# Altium schematic sheet Sheet1.SchDoc
size A3; SheetNumber: 1; SheetTotal: 1
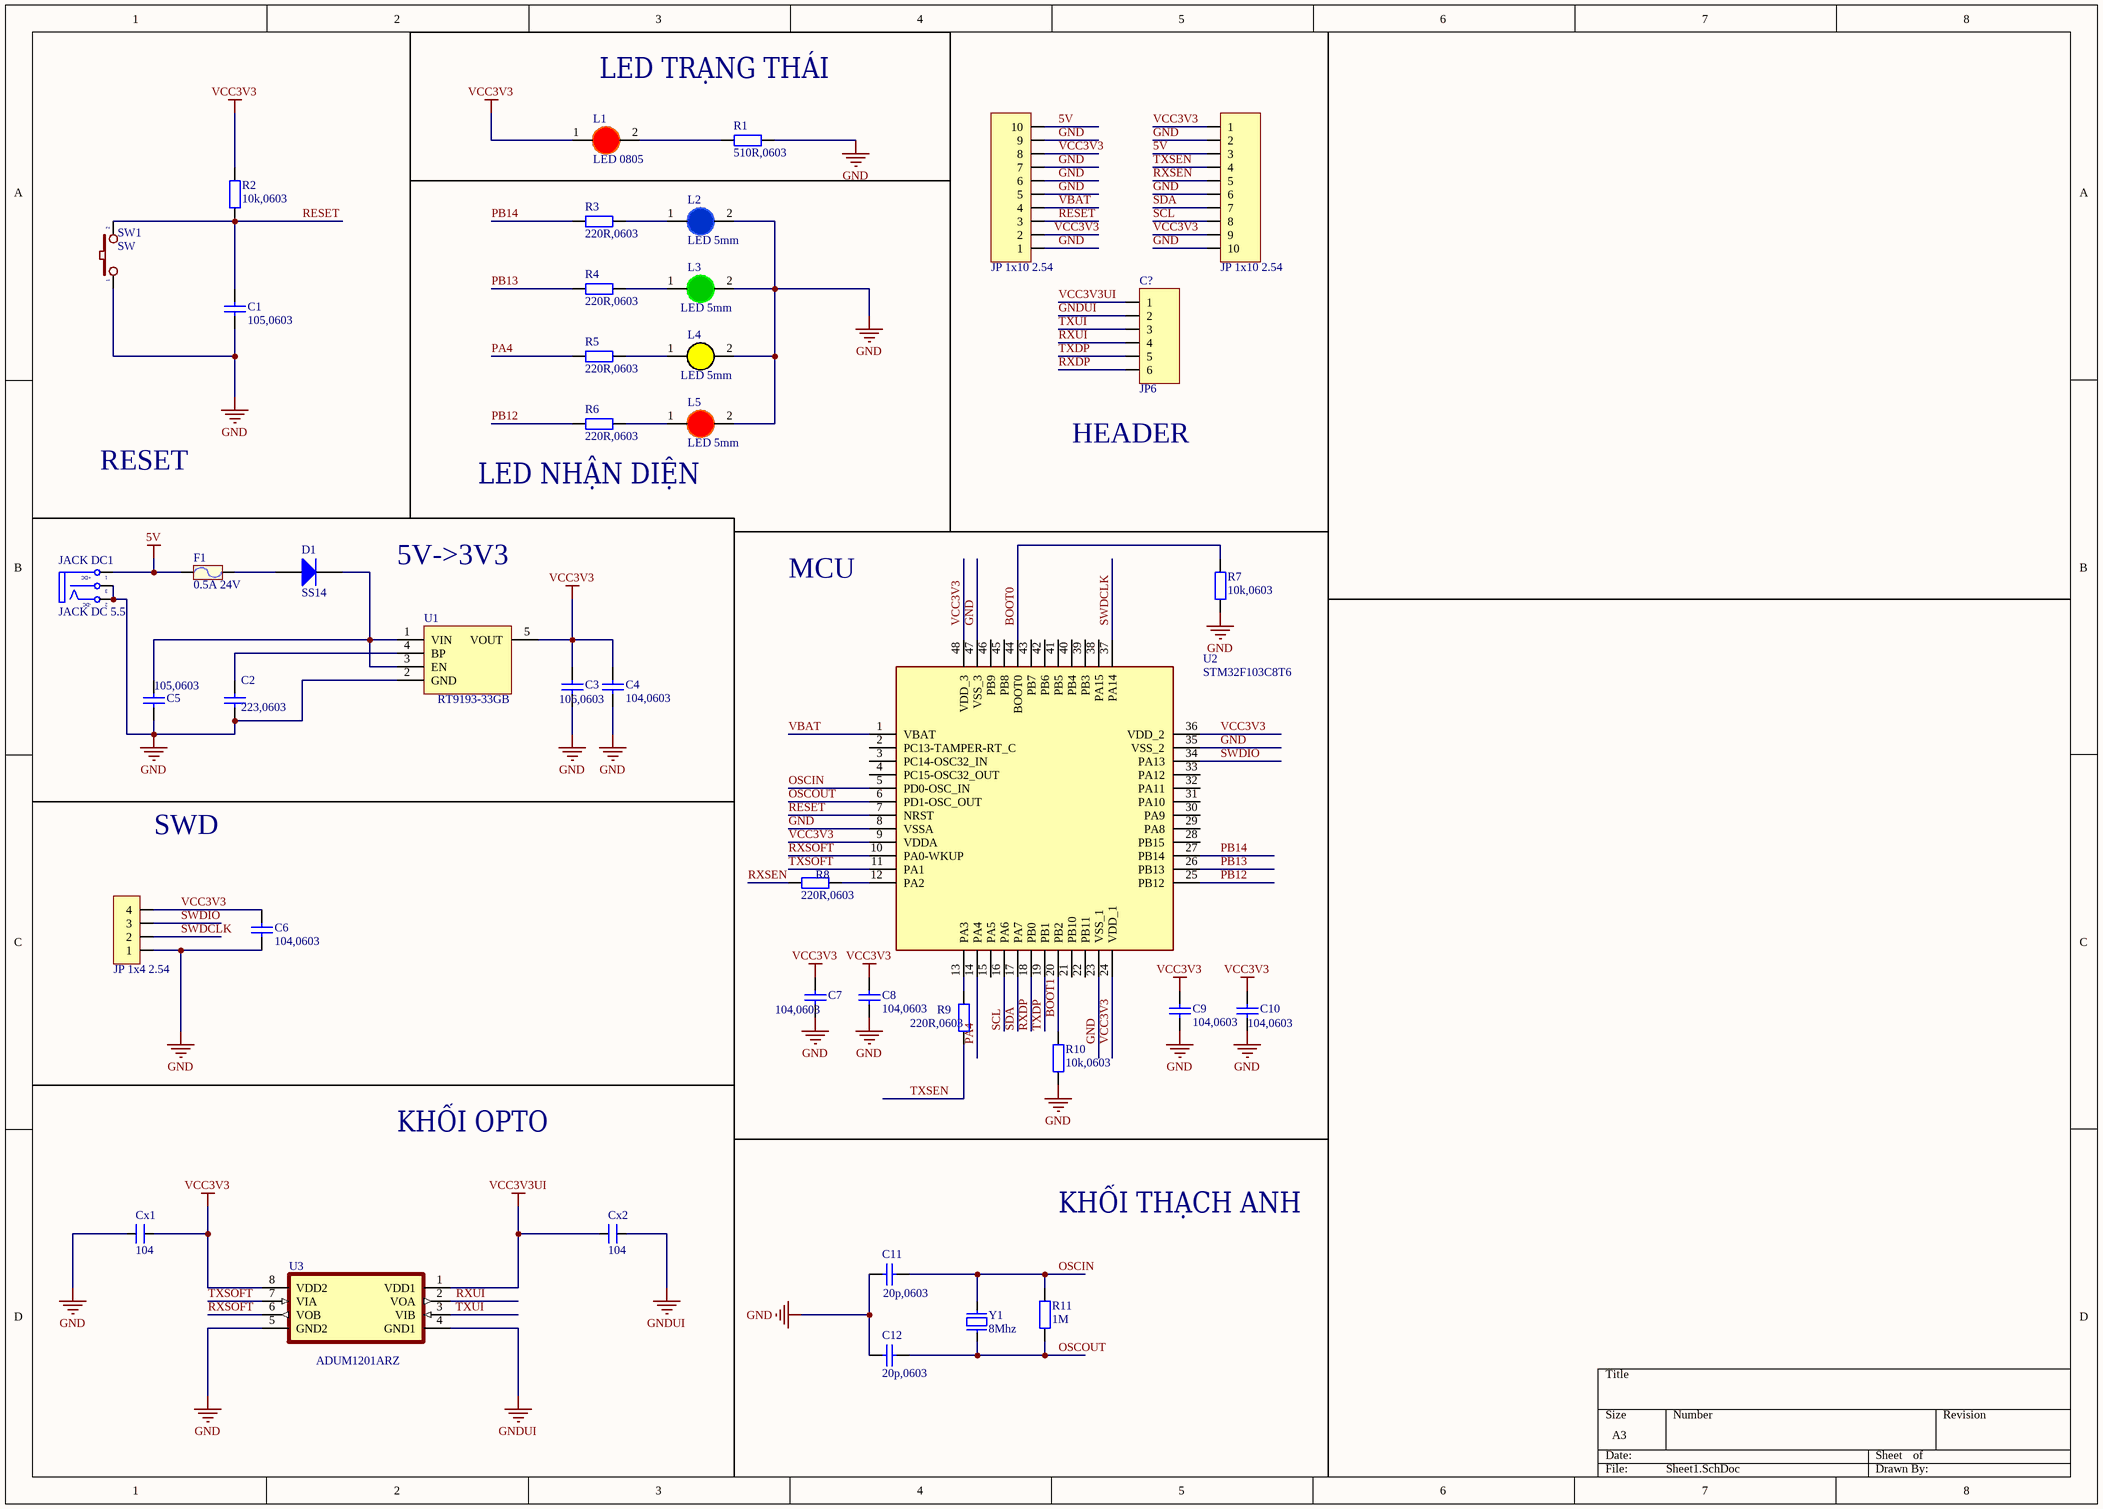
[diagram p0: Sheet1.SchDoc]

## Parts
C1  105,0603  [tu 0603]
C2  223,0603  [tu 0603]
C3  106,0603  [tu 0603]
C4  104,0603  [tu 0603]
C5  105,0603  [tu 0603]
C6  104,0603  [tu 0603]
C7  104,0603  [tu 0603]
C8  104,0603  [tu 0603]
C9  104,0603  [tu 0603]
C10  104,0603  [tu 0603]
C11  20p,0603  [tu 0603]
C12  20p,0603  [tu 0603]
C?  JP6  [JP6-D1C]
Cx1  104  [CN-SMD-0603]
Cx2  104  [CN-SMD-0603]
D1  SS14  [DIODE SMA]
F1  0.5A 24V  [Cau chi tu phuc hoi 2A 24V SMD1812]
JACK_DC1  JACK DC 5.5  [JACK DC 5.5]
JP1  JP 1x10 2.54  [JP 1x10 DT]
JP2  JP 1x10 2.54  [JP 1x10 DT]
JP4  JP 1x4 2.54  [JP 1x4 DC]
L1  LED 0805  [LED-0805-Red]
L2  LED 5mm  [LED-5MM-BLUE]
L3  LED 5mm  [LED-5MM-Green]
L4  LED 5mm  [LED-5MM-Yellow]
L5  LED 5mm  [LED-5MM-RED]
R1  510R,0603  [tro smd 0603]
R2  10k,0603  [tro smd 0603]
R3  220R,0603  [tro smd 0603]
R4  220R,0603  [tro smd 0603]
R5  220R,0603  [tro smd 0603]
R6  220R,0603  [tro smd 0603]
R7  10k,0603  [tro smd 0603]
R8  220R,0603  [tro smd 0603]
R9  220R,0603  [tro smd 0603]
R10  10k,0603  [tro smd 0603]
R11  1M  [tro smd 0603]
SW1  SW  [SW1-SMD]
U1  RT9193-33GB  [SOT23-5]
U2  STM32F103C8T6  [LQFP-48_19.6_393_58X11_SMD]
U3  ADUM1201ARZ  [SOIC127P600X175-8N]
Y1  8Mhz  [Thach Anh 2 chan cam]

## Nets
5V: F1.1 JACK_DC1.1(T) JP1.10 JP2.3
GND: C1.1 C2.1 C3.1 C4.1 C5.1 C6.1 C7.1 C8.1 C9.1 C10.1 C11.2 C12.2 Cx1.1 JACK_DC1.2(TN) JACK_DC1.3(S) JP1.1 JP1.5 JP1.6 JP1.7 JP1.9 JP2.2 JP2.6 JP2.10 JP4.1 L2.2(K) L3.2(K) L4.2(K) L5.2(K) R1.2 R7.2 R10.2 SW1.1 U1.2(GND) U2.8(VSSA) U2.23(VSS_1) U2.35(VSS_2) U2.47(VSS_3) U3.5(GND2)
GNDUI: C?.2 Cx2.2 U3.4(GND1)
VCC3V3: C3.2 C4.2 C6.2 C7.2 C8.2 C9.2 C10.2 Cx1.2 JP1.2 JP1.8 JP2.1 JP2.9 JP4.4 L1.1(A) R2.1 U1.5(VOUT) U2.9(VDDA) U2.24(VDD_1) U2.36(VDD_2) U2.48(VDD_3) U3.8(VDD2)
VCC3V3UI: C?.1 Cx2.1 U3.1(VDD1)
BOOT0: R7.1 U2.44(BOOT0)
BOOT1: R10.1 U2.20(PB2)
OSCIN: C11.1 R11.1 U2.5(PD0-OSC_IN) Y1.1
OSCOUT: C12.1 R11.2 U2.6(PD1-OSC_OUT) Y1.2
PA4: R5.1 U2.14(PA4)
PB12: R6.1 U2.25(PB12)
PB13: R4.1 U2.26(PB13)
PB14: R3.1 U2.27(PB14)
RESET: C1.2 JP1.3 R2.2 SW1.2 U2.7(NRST)
RXDP: C?.6 U2.18(PB0)
RXSEN: JP2.5 R8.2
RXSOFT: U2.10(PA0-WKUP) U3.6(VOB)
RXUI: C?.4 U3.2(VOA)
SCL: JP2.8 U2.16(PA6)
SDA: JP2.7 U2.17(PA7)
SWDCLK: JP4.2 U2.37(PA14)
SWDIO: JP4.3 U2.34(PA13)
TXDP: C?.5 U2.19(PB1)
TXSEN: JP2.4 R9.1
TXSOFT: U2.11(PA1) U3.7(VIA)
TXUI: C?.3 U3.3(VIB)
VBAT: JP1.4 U2.1(VBAT)
NetC2_2: C2.2 U1.4(BP)
NetC5_2: C5.2 D1.2(K) U1.1(VIN) U1.3(EN)
NetD1_1: D1.1(A) F1.2
NetL1_2: L1.2(K) R1.1
NetL2_1: L2.1(A) R3.2
NetL3_1: L3.1(A) R4.2
NetL4_1: L4.1(A) R5.2
NetL5_1: L5.1(A) R6.2
NetR8_1: R8.1 U2.12(PA2)
NetR9_2: R9.2 U2.13(PA3)

Not connected (* = marked no-connect by the designer): U2 2(PC13-TAMPER-RT_C) 3(PC14-OSC32_IN) 4(PC15-OSC32_OUT) 15(PA5) 21(PB10) 22(PB11) 28(PB15) 29(PA8) 30(PA9) 31(PA10) 32(PA11) 33(PA12) 38(PA15) 39(PB3) 40(PB4) 41(PB5) 42(PB6) 43(PB7) 45(PB8) 46(PB9)

## Notes on the sheet
- LED TRẠNG THÁI
- (near C?) HEADER
- RESET
- LED NHẬN DIỆN
- 5V->3V3
- MCU
- SWD
- KHỐI OPTO
- KHỐI THẠCH ANH
- (in symbol JACK DC 5.5) +DC; -DC

## Library data of the parts
C1 C5 = Tu 0603 105 16V 20%: Dán; Don_Vi: Con; So_Chan: 2; Ten_Linh_Kien: Tụ 0603 105-1uF 20% 16V; Ma_Hang: MH004574; Chung_Loai: Dán; Kieu_Chan: *
C2 C11 C12 = Tu 0603 22pF 50V 10%: Dán; Don_Vi: Con; So_Chan: 2; Ten_Linh_Kien: Tụ 0603 22pF 50V 10%; Ma_Hang: MH004570; Chung_Loai: Dán; Kieu_Chan: *
C3 = Tu 0603 106 16V 20%: Dán; Don_Vi: Con; So_Chan: 2; Ten_Linh_Kien: Tụ 0603-10uF 20% 16V; Ma_Hang: MH004848; Chung_Loai: Dán; Kieu_Chan: *
C4 C6-C10 = Tu 0603 104 50V 10%: Dán; Don_Vi: Con; So_Chan: 2; Ten_Linh_Kien: Tụ 0603 104-100nF 10% 50V; Ma_Hang: MH004568; Chung_Loai: Dán; Kieu_Chan: *
C? = JP6: WR-PHD 2.54 mm Angled Socket Header; Manufacturer: W¨¹rth Elektronik eiSos GmbH; partNo: 613006143121; ComponentLink1 Description: Manufacturer; ComponentLink2 Description: Datasheet; NoPins: 06; Created Date: 29 March 2013; ComponentLink1URL: http://www.we-online.com; ComponentLink2URL: http://katalog.we-online.de/em/datasheet/6130xx143121.pdf; Created by: Karrer Zheng
Cx1 Cx2 = CN: Value: 33pF
D1 = Diode SS14 ( 1N5819): Dán; Ma_Hang: MH002211; Don_Vi: Con; Ten_Linh_Kien: Diode SS14 DO214 Schottky 1A 40V ( 1N5819 DO214); Chung_Loai: Dán; Ghi_Chu: *; Kieu_Chan: *
F1 = Cau chi tu phuc hoi 2A 24V SMD1812: 2A 24V SMD1812; Ma_Hang: MH010033; Ten: Cầu Chì Tự Phục Hồi 2A 24V SMD1812
JACK_DC1 = JACK DC 5.5: Value: Jac DC
JP1 JP2 = JP 1x10 2.54 Duc Thang: Cắm; Ten_Linh_Kien: Jump Đơn Đực 2.54MM 1x40P Thẳng 11MM; Don_Vi: Con; Ma_Hang: MH000903; Ghi_Chu: *; Kieu_Chan: *; Chung_Loai: Cắm
JP4 = JP 1x4 2.54 Duc Cong: Cắm; Ten_Linh_Kien: Jump Đơn Đực 2.54MM 1x40P Cong Đứng; Don_Vi: Con; Ma_Hang: MH000904; Ghi_Chu: *; Kieu_Chan: *; Chung_Loai: Cắm
L1 = LED 0805 Do: Dán; Don_Vi: Con; Ma_Hang: MH000897; Ten_Linh_Kien: LED 0805 Màu Đỏ (Red); Ghi_Chu: *; Kieu_Chan: *; Chung_Loai: Dán
L2 = LED 5mm Xanh Duong: Cắm; Don_Vi: Con; Ma_Hang: MH008987; Ten_Linh_Kien: Led 5MM Xanh Dương Đục (1000c); Ghi_Chu: *; Kieu_Chan: *; Chung_Loai: Cắm
L3 = LED 5mm Xanh La: Cắm; Don_Vi: Con; Ma_Hang: MH008969; Ten_Linh_Kien: LED 5MM Phủ Xanh (1000c); Ghi_Chu: *; Kieu_Chan: *; Chung_Loai: Cắm
L4 = LED 5mm Vang: Cắm; Don_Vi: Con; Ma_Hang: MH008968; Ten_Linh_Kien: Led 5MM Phủ Vàng (1000c); Ghi_Chu: *; Kieu_Chan: *; Chung_Loai: Cắm
L5 = LED 5mm Do: Cắm; Don_Vi: Con; Ma_Hang: MH008967; Ten_Linh_Kien: Led 5MM Phủ Đỏ (1000c); Ghi_Chu: *; Kieu_Chan: *; Chung_Loai: Cắm
R1 = Tro 0603 5% 510R: Dán; Don_Vi: Con; So_Chan: 2; Ten_Linh_Kien: Trở 0603 5% 510R; Ma_Hang: MH007667; Chung_Loai: Dán; Kieu_Chan: *
R2 R7 R10 = Tro 0603 1% 10k: Dán; Don_Vi: Con; So_Chan: 2; Ten_Linh_Kien: Trở 0603 1% 10k; Ma_Hang: MH006333; Chung_Loai: Dán; Kieu_Chan: *
R3-R6 R8 R9 = Tro 0603 5% 220R: Dán; Don_Vi: Con; So_Chan: 2; Ten_Linh_Kien: Trở 0603 5% 220R; Ma_Hang: MH006322; Chung_Loai: Dán; Kieu_Chan: *
R11 = Tro 0603 5% 1M: Dán; Don_Vi: Con; So_Chan: 2; Ten_Linh_Kien: Trở 0603 5% 1M; Ma_Hang: MH006909; Chung_Loai: Dán; Kieu_Chan: *
SW1 = SW2: Switch button 2 pin; Value: SW chip 2 pin
U1 = REG_5.5V-3.3V-0.3A-1W-SOT-23-5: Linear Voltage Regulator IC 1 Output 300mA SOT-23-5; Manufacturer: Richtek USA Inc.; Alternate Part Number-1: NA; Manufacturer Part Number: RT9193-33GB; Supplier-1: LCSC; Supplier Part Number-1: C15651; Case/Package: SOT-23-5
U2 = IC_STM32F103C8T6: ARM® Cortex®-M3 STM32F1 Microcontroller IC 32-Bit 72MHz 64KB (64K x 8) FLASH 48-LQFP (7x7); Manufacturer: STMicroelectronics; Alternate Part Number-1: NA; Manufacturer Part Number: STM32F103C8T6; Case/Package: LQFP48; Supplier-1: LCSC; Supplier Part Number-1: STM32F103C8T6
U3 = ADUM1201ARZ: Digital Isolator CMOS 2-CH 1Mbps 8-Pin SOIC N Tube; MF: Analog Devices; MP: ADUM1201ARZ .; SnapEDA_Link: https://www.snapeda.com/parts/ADUM1201ARZ%20./Analog+Devices/view-part/?ref=snap; Package: None; Value: *; Check_prices: https://www.snapeda.com/parts/ADUM1201ARZ%20./Analog+Devices/view-part/?ref=eda
Y1 = Thach Anh 2 chan Cam: Crystal For all Crystal 2pin.; Value: 4Mhz